# Altium project Hall sensor V1.PrjPcb (part 2 of 2)

## Sheet Hall sensor V1 power.SchDoc
size A4
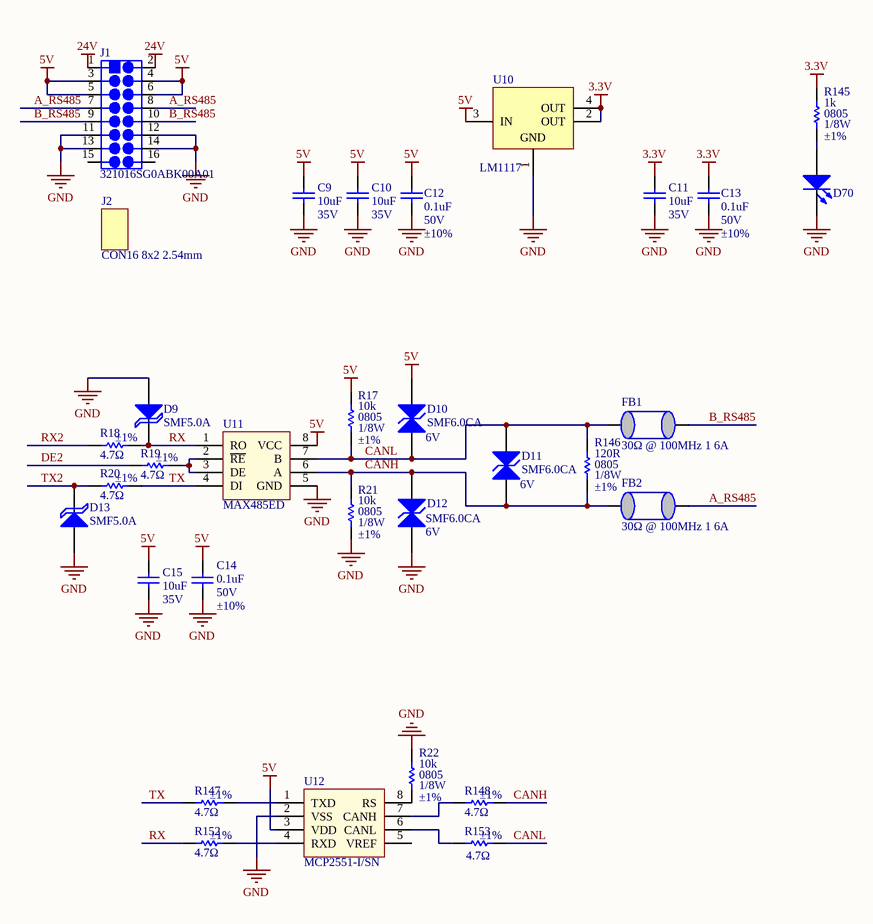
[diagram p3: Hall sensor V1 power.SchDoc]

### Parts
C9  Voltage: 35V  [CAP_SMD_0805]  (hidden comment: 10uF)
C10  Voltage: 35V  [CAP_SMD_0805]  (hidden comment: 10uF)
C11  Voltage: 35V  [CAP_SMD_0805]  (hidden comment: 10uF)
C12  Voltage: 50V  Tolerance: ±10%  [CAP_SMD_0805]  (hidden comment: 0.1uF)
C13  Voltage: 50V  Tolerance: ±10%  [CAP_SMD_0805]  (hidden comment: 0.1uF)
C14  Voltage: 50V  Tolerance: ±10%  [CAP_SMD_0805]  (hidden comment: 0.1uF)
C15  Voltage: 35V  [CAP_SMD_0805]  (hidden comment: 10uF)
D9  SMF5.0A  [SOD-123]
D10  SMF6.0CA  Voltage: 6V  [SOD-123]
D11  SMF6.0CA  Voltage: 6V  [SOD-123]
D12  Voltage: 6V  [SOD-123]  (hidden comment: SMF6.0CA)
D13  SMF5.0A  [SOD-123]
D70  17-21/R6C-AQ2R2B/3T  [LED_SMD0805]  (value not drawn)
FB1  30Ω @ 100MHz 1 6A  [Inductor 0805]
FB2  30Ω @ 100MHz 1 6A  [Inductor 0805]
J1  MANUFACTURER1_PART#: 321016SG0ABK00A01  [Header IDC 8x2 2.54mm through hold]  (hidden comment: header16 8x2 2.54mm)
J2  CON16 8x2 2.54mm  (mechanical)
R17  PCB Footprint: 0805  Power: 1/8W  Tolerance: ±1%  [RES_SMD_0805]  (hidden comment: 10k)
R18  value 4.7Ω  Tolerance: ±1%  [RES_SMD_0805]  (hidden comment: 4.7R)
R19  value 4.7Ω  Tolerance: ±1%  [RES_SMD_0805]  (hidden comment: 4.7R)
R20  value 4.7Ω  Tolerance: ±1%  [RES_SMD_0805]  (hidden comment: 4.7R)
R21  PCB Footprint: 0805  Power: 1/8W  Tolerance: ±1%  [RES_SMD_0805]  (hidden comment: 10k)
R22  PCB Footprint: 0805  Power: 1/8W  Tolerance: ±1%  [RES_SMD_0805]  (hidden comment: 10k)
R145  value 1k  PCB Footprint: 0805  Power: 1/8W  Tolerance: ±1%  [RES_SMD_0805]  (hidden comment: 10k)
R146  PCB Footprint: 0805  Power: 1/8W  Tolerance: ±1%  [RES_SMD_0805]  (hidden comment: 120R)
R147  value 4.7Ω  Tolerance: ±1%  [RES_SMD_0805]  (hidden comment: 4.7R)
R148  value 4.7Ω  Tolerance: ±1%  [RES_SMD_0805]  (hidden comment: 4.7R)
R152  value 4.7Ω  Tolerance: ±1%  [RES_SMD_0805]  (hidden comment: 4.7R)
R153  value 4.7Ω  Tolerance: ±1%  [RES_SMD_0805]  (hidden comment: 4.7R)
U10  LM1117  [SOT223]
U11  MAX485ED  [SOIC8]
U12  MCP2551-I/SN  [SOIC8]

### Nets
3.3V: C11.1 C13.2 R145.2 U10.2(OUT) U10.4(OUT)
5V: C9.1 C10.1 C12.2 C14.2 C15.1 D10.1(K) J1.3 J1.4 J1.5 J1.6 R17.2 U10.3(IN) U11.8(VCC) U12.3(VDD)
24V: J1.1 J1.2
GND: C9.2 C10.2 C11.2 C12.1 C13.1 C14.1 C15.2 D9.2(A) D12.2(A) D13.2(A) D70.1(A) J1.11 J1.12 J1.13 J1.14 R21.1 R22.2 U10.1(GND) U11.5(GND) U12.2(VSS)
A_RS485: FB2.2 J1.7 J1.8
B_RS485: FB1.2 J1.9 J1.10
CANH: D11.2(A) D12.1(K) FB2.1 R21.2 R146.1 R148.1 U11.6(A)
CANL: D10.2(A) D11.1(K) FB1.1 R17.1 R146.2 R153.1 U11.7(B)
DE2: R19.2
RX: D9.1(K) R18.1 R152.2 U11.1(RO)
RX2: R18.2
TX: R20.1 R147.2 U11.4(DI)
TX2: D13.1(K) R20.2
NetD70_2: D70.2(K) R145.1
NetR19_1: R19.1 U11.2(~{RE}) U11.3(DE)
NetR22_1: R22.1 U12.8(RS)
NetR147_1: R147.1 U12.1(TXD)
NetR148_2: R148.2 U12.7(CANH)
NetR152_1: R152.1 U12.4(RXD)
NetR153_2: R153.2 U12.6(CANL)

Not connected (* = marked no-connect by the designer): J1 15 16; J2 1 2; U12 5(VREF)

### Library data of the parts
C9-C11 C15 = Cap-NP-100: 10uF ±10% 35V X5R 0805 Multilayer Ceramic Capacitors MLCC - SMD/SMT RoHS; MANUFACTURER1: Murata Electronics; MANUFACTURER1_PART#: GRM21BR6YA106KE43L; MANUFACTURER2_PART#: C2012X5R1V106MT000E; PACKING: Tape & Reel (TR); PCB Footprint: 0805; Process Type: SM; Unit: PCS; By: Thanh Son; Value: 10uF; MANUFACTURER2: TDK; Tolerance: ±10%; Material: X5R; Category: Cap Cereramic; Mounting Type: SM; Package / Case: 0805; Supplier 1: LCSC
C12-C14 = Cap-NP-100: 100nF ±10% 50V X7R 0805 Multilayer Ceramic Capacitors MLCC - SMD/SMT RoHS; MANUFACTURER1: TORCH; MANUFACTURER1_PART#: C0805B104K500NT; MANUFACTURER2_PART#: TCC0805X7R104K500DT; PACKING: Tape & Reel (TR); PCB Footprint: 0805; Process Type: SM; Unit: PCS; By: Thanh Son; Value: 0.1uF; MANUFACTURER2: CCTC; Material: X7R; Category: Cap Cereramic; Mounting Type: SM; Package / Case: 0805; Supplier 1: LCSC
D9 D13 = TVS SMF26A: SOD-123FL TVS RoHS; MANUFACTURER1: Slkor(SLKORMICRO Elec.); Current: 4.8mA; PACKING: Tape & Reel; Process Type: SM; Unit: PCS; Value: SMF26A; By: Thanh Son; MANUFACTURER2: SUNMATE Elec; MANUFACTURER2_PART#: SMF5.0A; MANUFACTURER1_PART#: SMF5.0A; Category: ESD/TVS; Mounting Type: SM; Package / Case: SOD-123; Supplier 1: LCSC
D10-D12 = TVS SMF05CA  SOD123: Bidirectional 6V 6.67V 10.3V 19.4mA SOD-123FL TVS RoHS; MANUFACTURER1: SUNMATE Elec; PACKING: Tape & Reel; Process Type: SM; Unit: PCS; By: Thanh Son; MANUFACTURER1_PART#: SMF6.0CA; MANUFACTURER2: ZHIDE; MANUFACTURER2_PART#: SMF6.0CA; Category: ESD/TVS; Mounting Type: SM; Package / Case: SOD-123; Supplier 1: LCSC
D70 = LED_RED_SMD_0805: Red 617.5~633.5nm 0805 Light Emitting Diodes (LED) ROHS; MANUFACTURER1: Everlight Elec; MANUFACTURER2_PART#: HSMH-C170; PACKING: Tape & Reel (TR); Process Type: SM; Category: LED; MANUFACTURER1_PART#: 17-21/R6C-AQ2R2B/3T; MANUFACTURER2: AVAGO(Broadcom); Supplier 1: LCSC
FB1 FB2 = inductor ferrite bead: 30Ω @ 100MHz 1 6A 10mΩ 0805 Ferrite Beads ROHS; MANUFACTURER1: FH(Guangdong Fenghua Advanced Tech); MANUFACTURER1_PART#: CBM201209U300T; MANUFACTURER2_PART#: HCB2012KF-300T60; PACKING: Tape & Reel; Process Type: SM; By: Thanh Son; Category: Ferrite bead; MANUFACTURER2: TAI-TECH; Mounting Type: SM; Package / Case: 0805; Supplier 1: LCSC
J1 = header 8x2 JILN: 16 2 0.100"(2.54mm) Header Through Hole,P=2.54mm IDC Connectors ROHS; MANUFACTURER1: JILN; MANUFACTURER2_PART#: B-3000S16P-0110; Current: 3A; PACKING: Bag-packed; Process Type: SM; By: Thanh Son; Category: Connector; MANUFACTURER2: Ckmtw(Shenzhen Cankemeng); Package / Case: Header IDC 8x2; Supplier 1: LCSC; Mounting Type: MA
J2 = CON 2 WJ2EDGR-5.08-2P: 16 2 0.100"(2.54mm) - IDCconnector P=2.54mm IDC Connectors ROHS; MANUFACTURER1: JILN; MANUFACTURER1_PART#: 531416YBS0BW01; MANUFACTURER2_PART#: I-1010316P-B000; Current: 3A; PACKING: Bag-packed; Process Type: ASY; Unit: PCS; By: Thanh Son; MANUFACTURER2: Ckmtw(Shenzhen Cankemeng); Category: Connector; Mounting Type: ASY; Supplier 1: LCSC
R17 R21 R22 = Res0.3: 10kΩ ±1% 1/8W ±100ppm/℃ 0805 Chip Resistor - Surface Mount RoHS; MANUFACTURER1: UNI-ROYAL(Uniroyal Elec); MANUFACTURER1_PART#: 0805W8F1002T5E; MANUFACTURER2_PART#: RS-05K1002FT; PACKING: Tape & Reel (TR); Process Type: SM; Unit: PCS; By: Thanh Son; Value: 10k; MANUFACTURER2: FH(Guangdong Fenghua Advanced Tech); Category: Resistor; Mounting Type: SM; Package / Case: 0805; Supplier 1: LCSC
R18-R20 R147 R148 R152 R153 = Res0.3: 4.7Ω ±1% ±400ppm/℃ 0.125W 0805 Chip Resistor - Surface Mount ROHS; MANUFACTURER1: UNI-ROYAL(Uniroyal Elec); MANUFACTURER1_PART#: 0805W8F470KT5E; MANUFACTURER2_PART#: RC0805FR-074R7L; PACKING: Tape & Reel (TR); PCB Footprint: 0805; Process Type: SM; Unit: PCS; Power: 1/8W; MANUFACTURER2: YAGEO; Category: Resistor; Mounting Type: SM; Package / Case: 0805; Supplier 1: LCSC
R145 = Res0.3: 10kΩ ±1% 1/8W ±100ppm/℃ 0805 Chip Resistor - Surface Mount RoHS; MANUFACTURER1: YAGEO; MANUFACTURER1_PART#: AC0805FR-071KL; MANUFACTURER2_PART#: WR08X1001FTL; PACKING: Tape & Reel (TR); Process Type: SM; Unit: PCS; By: Thanh Son; MANUFACTURER2: Walsin Tech Corp; Category: Resistor; Mounting Type: SM; Package / Case: 0805; Supplier 1: LCSC
R146 = Res0.3: ±1% ±100ppm/℃ 120Ω 0.125W 0805 Chip Resistor - Surface Mount ROHS; MANUFACTURER1: UNI-ROYAL(Uniroyal Elec); MANUFACTURER1_PART#: 0805W8F1200T5E; MANUFACTURER2_PART#: AC0805FR-7W120RL; PACKING: Tape & Reel (TR); Process Type: SM; Unit: PCS; By: Thanh Son; Value: 120R; MANUFACTURER2: YAGEO; Category: Resistor; Mounting Type: SM; Package / Case: 0805; Supplier 1: LCSC
U10 = LM1117: Fixed 18V 3.3V 1.4V @ 1A SOT-223 Dropout Regulators(LDO) RoHS; MANUFACTURER1: Slkor(SLKORMICRO Elec.); MANUFACTURER1_PART#: AMS1117-3.3; PACKING: Tape & Reel; Process Type: SM; Unit: PCS; By: Thanh Son; MANUFACTURER2: PUOLOP; MANUFACTURER2_PART#: AMS1117-3.3; Value: 3.3V; Current: 1A; Voltage: 3.3V; Category: IC; Mounting Type: SM; Package / Case: SOT223; Supplier 1: LCSC
U11 = RS 485 SIT3485ESA: Transceiver RS485 1/1 200kbps SOIC-8_150mil RS-485/RS-422 ICs RoHS; MANUFACTURER1: HTC Korea TAEJIN Tech; MANUFACTURER2_PART#: CBM485AS8; PACKING: Tape & Reel; Process Type: SM; Unit: PCS; By: Thanh Son; MANUFACTURER1_PART#: MAX485ED; MANUFACTURER2: Corebai Microelectronics; Category: IC; Mounting Type: SM; Package / Case: SOP-8; Supplier 1: LCSC
U12 = CAN MCP2551-I/SN: Transceiver 1/1 CAN - SOIC-8_150mil CAN ICs ROHS; MANUFACTURER1: Microchip Tech; MANUFACTURER2_PART#: PCA82C250T/YM,118; PACKING: Tape & Reel; Process Type: SM; Unit: PCS; By: Thanh Son; Category: IC; MANUFACTURER1_PART#: MCP2551-I/SN; MANUFACTURER2: NXP Semicon; Mounting Type: SM; Package / Case: SOIC8; Supplier 1: LCSC

## Sheet hall sensor MCU_1.SchDoc
size A3
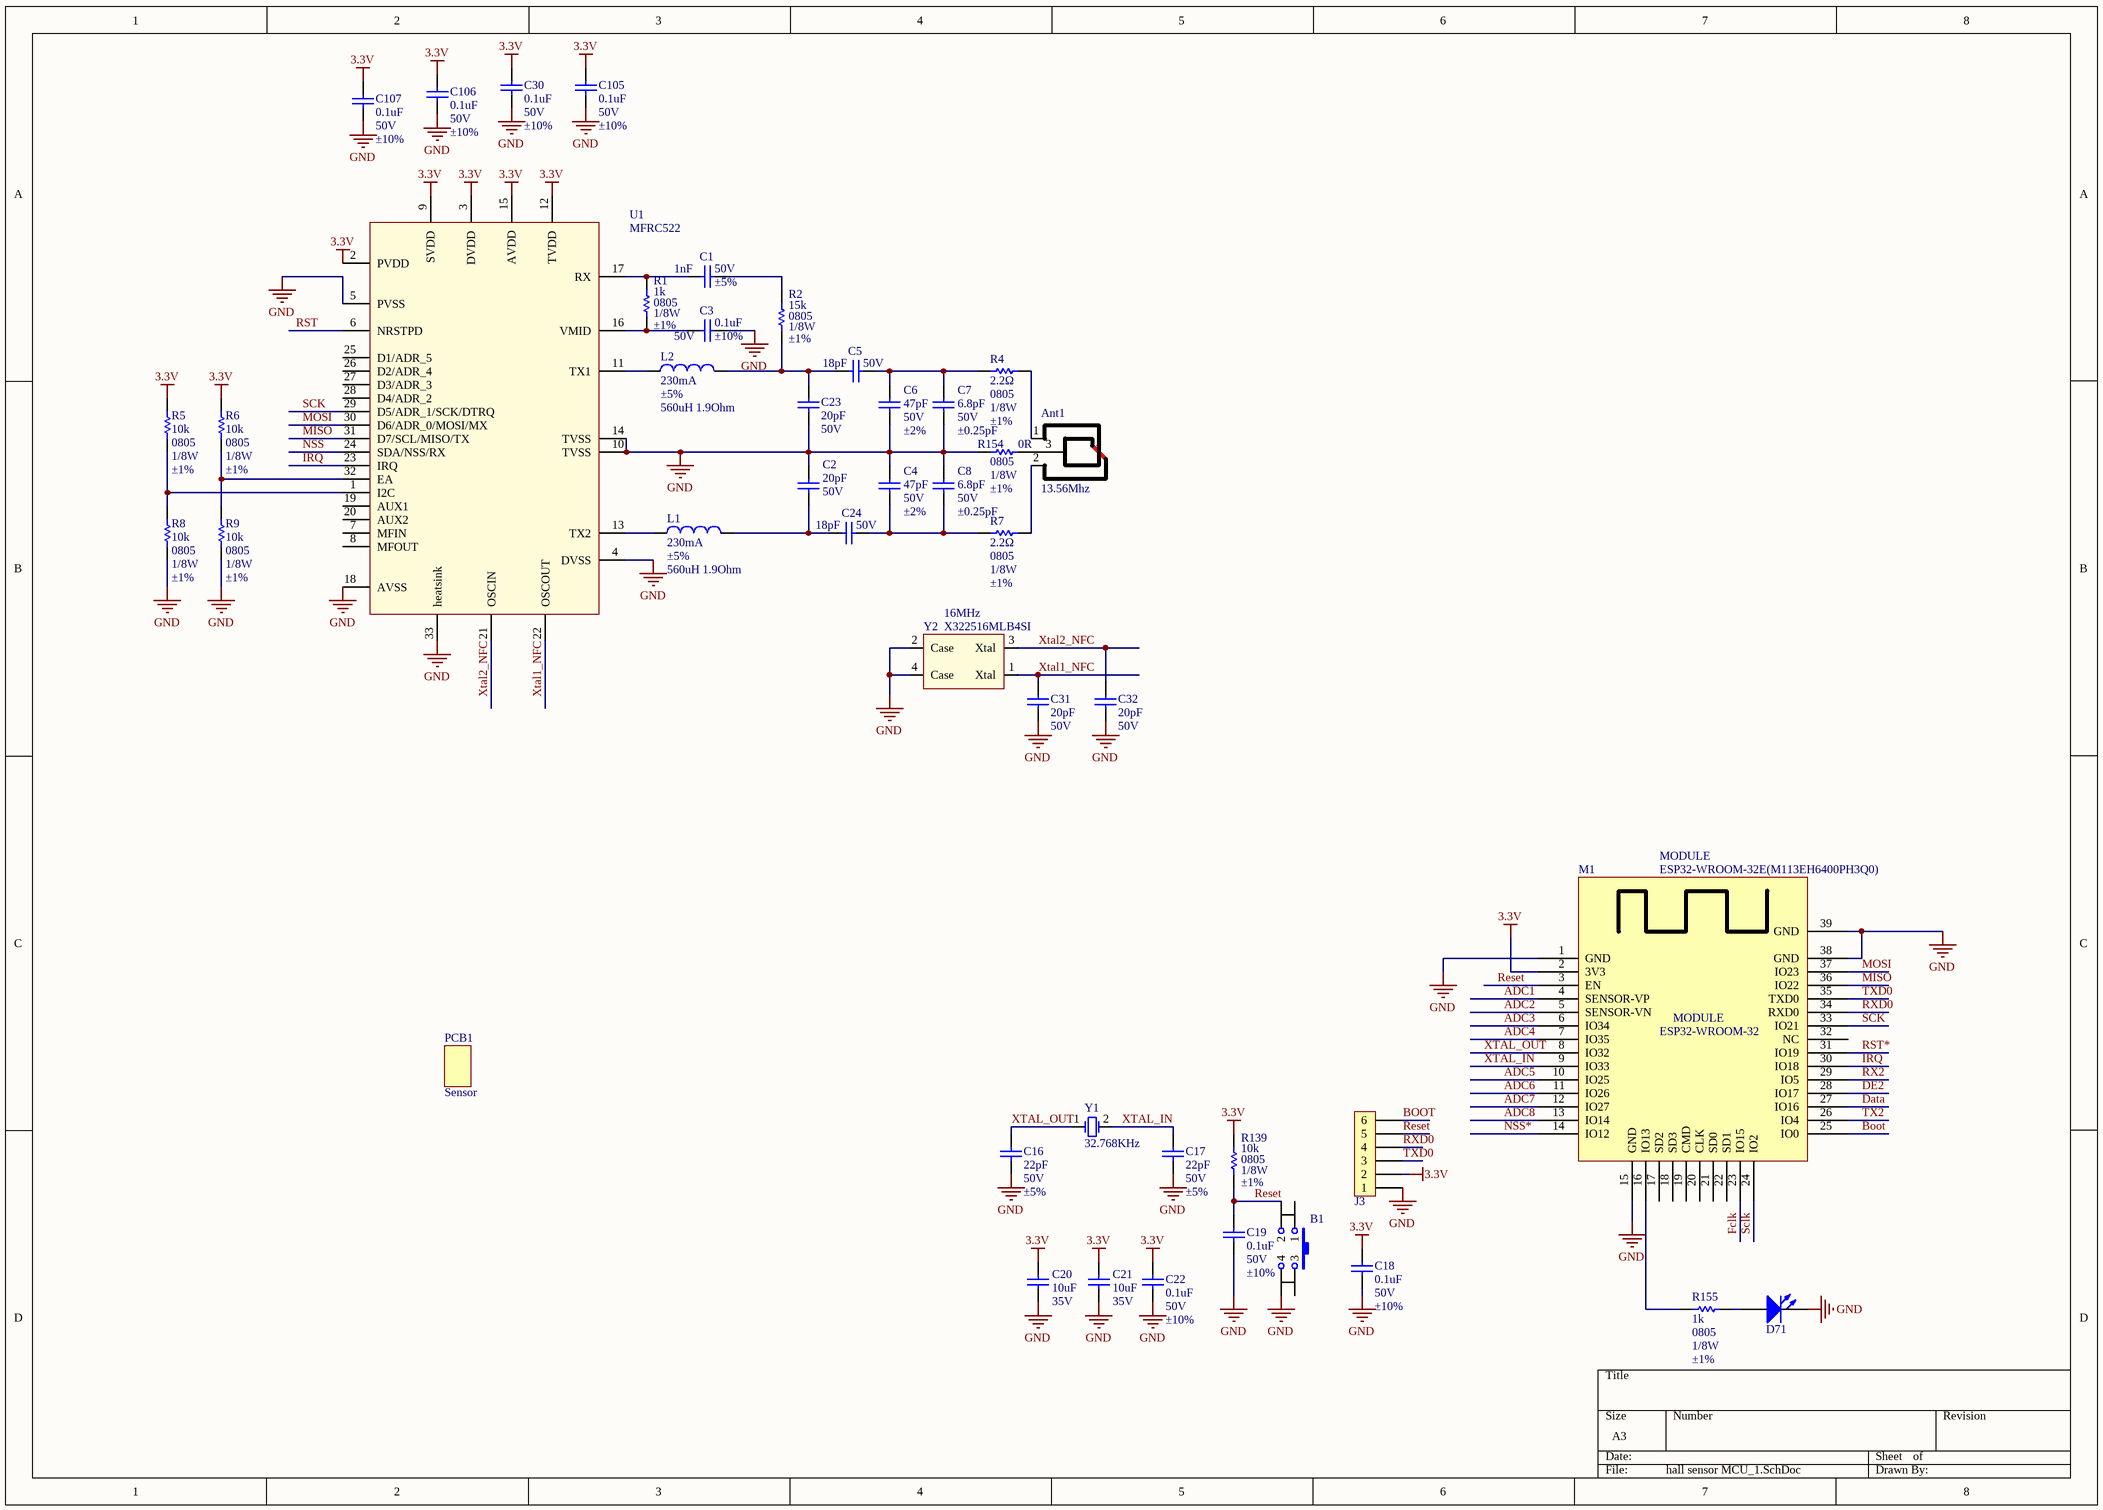
[diagram p4: hall sensor MCU_1.SchDoc]

### Parts
Ant1  13.56Mhz  [antenna 13.56_V2]  (no BOM)
B1  button SMD 6x6x5  [button 250 smd]  (value not drawn)
C1  Voltage: 50V  Tolerance: ±5%  [CAP_SMD_0805]  (hidden comment: 1nF)
C2  value 20pF  Voltage: 50V  [CAP_SMD_0805]  (hidden comment: 220pF)
C3  Voltage: 50V  Tolerance: ±10%  [CAP_SMD_0805]  (hidden comment: 0.1uF)
C4  Voltage: 50V  Tolerance: ±2%  [CAP_SMD_0805]  (hidden comment: 47pF)
C5  Voltage: 50V  [CAP_SMD_0805]  (hidden comment: 18pF)
C6  Voltage: 50V  Tolerance: ±2%  [CAP_SMD_0805]  (hidden comment: 47pF)
C7  Voltage: 50V  Tolerance: ±0.25pF  [CAP_SMD_0805]  (hidden comment: 6.8pF)
C8  Voltage: 50V  Tolerance: ±0.25pF  [CAP_SMD_0805]  (hidden comment: 6.8pF)
C16  Voltage: 50V  Tolerance: ±5%  [CAP_SMD_0805]  (hidden comment: 22pF)
C17  Voltage: 50V  Tolerance: ±5%  [CAP_SMD_0805]  (hidden comment: 22pF)
C18  Voltage: 50V  Tolerance: ±10%  [CAP_SMD_0805]  (hidden comment: 0.1uF)
C19  Voltage: 50V  Tolerance: ±10%  [CAP_SMD_0805]  (hidden comment: 0.1uF)
C20  Voltage: 35V  [CAP_SMD_0805]  (hidden comment: 10uF)
C21  Voltage: 35V  [CAP_SMD_0805]  (hidden comment: 10uF)
C22  Voltage: 50V  Tolerance: ±10%  [CAP_SMD_0805]  (hidden comment: 0.1uF)
C23  value 20pF  Voltage: 50V  [CAP_SMD_0805]  (hidden comment: 220pF)
C24  Voltage: 50V  [CAP_SMD_0805]  (hidden comment: 18pF)
C30  Voltage: 50V  Tolerance: ±10%  [CAP_SMD_0805]  (hidden comment: 0.1uF)
C31  value 20pF  Voltage: 50V  [CAP_SMD_0805]  (hidden comment: 0.1uF)
C32  value 20pF  Voltage: 50V  [CAP_SMD_0805]  (hidden comment: 0.1uF)
C105  Voltage: 50V  Tolerance: ±10%  [CAP_SMD_0805]  (hidden comment: 0.1uF)
C106  Voltage: 50V  Tolerance: ±10%  [CAP_SMD_0805]  (hidden comment: 0.1uF)
C107  Voltage: 50V  Tolerance: ±10%  [CAP_SMD_0805]  (hidden comment: 0.1uF)
D71  17-21/R6C-AQ2R2B/3T  [LED_SMD0805]  (value not drawn)
J3  JUMPER 6  [JUMPER6]  (value not drawn)  (no BOM)
L1  value 560uH 1.9Ohm  Current: 230mA  Tolerance: ±5%  [Inductor 0805]  (hidden comment: 560uH)
L2  value 560uH 1.9Ohm  Current: 230mA  Tolerance: ±5%  [Inductor 0805]  (hidden comment: 560uH)
M1  Category: MODULE  MANUFACTURER1_PART#: ESP32-WROOM-32E(M113EH6400PH3Q0)  [ESP-WROOM-32]  (hidden comment: ESP32-WROOM-32E(16MB))
PCB1  Sensor  (mechanical)
R1  value 1k  PCB Footprint: 0805  Power: 1/8W  Tolerance: ±1%  [RES_SMD_0805]  (hidden comment: 10k)
R2  PCB Footprint: 0805  Power: 1/8W  Tolerance: ±1%  [RES_SMD_0805]  (hidden comment: 15k)
R4  value 2.2Ω  PCB Footprint: 0805  Power: 1/8W  Tolerance: ±1%  [RES_SMD_0805]  (hidden comment: 2.2R)
R5  PCB Footprint: 0805  Power: 1/8W  Tolerance: ±1%  [RES_SMD_0805]  (hidden comment: 10k)
R6  PCB Footprint: 0805  Power: 1/8W  Tolerance: ±1%  [RES_SMD_0805]  (hidden comment: 10k)
R7  value 2.2Ω  PCB Footprint: 0805  Power: 1/8W  Tolerance: ±1%  [RES_SMD_0805]  (hidden comment: 2.2R)
R8  PCB Footprint: 0805  Power: 1/8W  Tolerance: ±1%  [RES_SMD_0805]  (hidden comment: 10k)
R9  PCB Footprint: 0805  Power: 1/8W  Tolerance: ±1%  [RES_SMD_0805]  (hidden comment: 10k)
R139  PCB Footprint: 0805  Power: 1/8W  Tolerance: ±1%  [RES_SMD_0805]  (hidden comment: 10k)
R154  0R  PCB Footprint: 0805  Power: 1/8W  Tolerance: ±1%  [RES_SMD_0805]
R155  value 1k  PCB Footprint: 0805  Power: 1/8W  Tolerance: ±1%  [RES_SMD_0805]  (hidden comment: 10k)
U1  MFRC522  [HVQFN32]
Y1  32.768KHz  [FC135]
Y2  MANUFACTURER1_PART#: X322516MLB4SI  [Crystal 3.2x2.5mm 4Pin]  (hidden comment: 16MHz)

### Nets
3.3V: C18.2 C20.1 C21.1 C22.2 C30.2 C105.2 C106.2 C107.2 J3.2 M1.2(3V3) R5.1 R6.1 R139.2 U1.2(PVDD) U1.3(DVDD) U1.9(SVDD) U1.12(TVDD) U1.15(AVDD)
GND: B1.4 C2.2 C3.1 C4.1 C6.2 C7.2 C8.1 C16.1 C17.1 C18.1 C19.1 C20.2 C21.2 C22.1 C23.1 C30.1 C31.1 C32.1 C105.1 C106.1 C107.1 D71.1(A) J3.1 M1.1(GND) M1.15(GND) M1.38(GND) M1.39(GND) R8.2 R9.2 R154.2 U1.4(DVSS) U1.5(PVSS) U1.10(TVSS) U1.14(TVSS) U1.18(AVSS) U1.33(heatsink) Y2.2(Case) Y2.4(Case)
ADC1: M1.4(SENSOR-VP)
ADC2: M1.5(SENSOR-VN)
ADC3: M1.6(IO34)
ADC4: M1.7(IO35)
ADC5: M1.10(IO25)
ADC6: M1.11(IO26)
ADC7: M1.12(IO27)
ADC8: M1.13(IO14)
Boot: J3.6 M1.25(IO0)
Data: M1.27(IO16)
DE2: M1.28(IO17)
Fclk: M1.23(IO15)
IRQ: M1.30(IO18) U1.23(IRQ)
MISO: M1.36(IO22) U1.31(D7/SCL/MISO/TX)
MOSI: M1.37(IO23) U1.30(D6/ADR_0/MOSI/MX)
NSS: U1.24(SDA/NSS/RX)
NSS*: M1.14(IO12)
Reset: B1.2 C19.2 J3.5 M1.3(EN) R139.1
RST: U1.6(NRSTPD)
RST*: M1.31(IO19)
RX2: M1.29(IO5)
RXD0: J3.4 M1.34(RXD0)
SCK: M1.33(IO21) U1.29(D5/ADR_1/SCK/DTRQ)
Sclk: M1.24(IO2)
TX2: M1.26(IO4)
TXD0: J3.3 M1.35(TXD0)
Xtal1_NFC: C31.2 U1.22(OSCOUT) Y2.1(Xtal)
Xtal2_NFC: C32.2 U1.21(OSCIN) Y2.3(Xtal)
XTAL_IN: C17.2 M1.9(IO33) Y1.2(OSC2)
XTAL_OUT: C16.2 M1.8(IO32) Y1.1(OSC1)
NetAnt1_1: Ant1.1 R4.1
NetAnt1_2: Ant1.2 R7.1
NetAnt1_3: Ant1.3 R154.1
NetC1_1: C1.1 R2.2
NetC1_2: C1.2 R1.2 U1.17(RX)
NetC2_1: C2.1 C24.2 L1.2
NetC3_2: C3.2 R1.1 U1.16(VMID)
NetC4_2: C4.2 C8.2 C24.1 R7.2
NetC5_1: C5.1 C6.1 C7.1 R4.2
NetC5_2: C5.2 C23.2 L2.2 R2.1
NetD71_2: D71.2(K) R155.1
NetL1_1: L1.1 U1.13(TX2)
NetL2_1: L2.1 U1.11(TX1)
NetM1_16: M1.16(IO13) R155.2
NetR5_2: R5.2 R8.1 U1.1(I2C)
NetR6_2: R6.2 R9.1 U1.32(EA)

Not connected (* = marked no-connect by the designer): B1 1 3; M1 17(SD2) 18(SD3) 19(CMD) 20(CLK) 21(SD0) 22(SD1) 32(NC); U1 7(MFIN) 8(MFOUT) 19(AUX1) 20(AUX2) 25(D1/ADR_5) 26(D2/ADR_4) 27(D3/ADR_3) 28(D4/ADR_2)

### Notes on the sheet
- (in symbol ESP32-) ESP32-WROOM-32

### Library data of the parts
Ant1 = antenna 13.56V2: By: Thanh Son; Package / Case: Antenna 13.56V2Mhz
B1 = button 250_SMD: SPST 50mA @ 12VDC Vertical Round Button SMD,6x6x5mm Tactile Switches RoHS; MANUFACTURER1: HYP (Hongyuan Precision); MANUFACTURER1_PART#: 1TS005F-2500-5001; MANUFACTURER2_PART#: TS-1002S-04526C; PACKING: Tape & Reel (TR); Process Type: SM; Unit: PCS; By: Thanh Son; Current: 50mA; MANUFACTURER2: XUNPU; Category: Button/Switch; Mounting Type: SM; Package / Case: 6x6x5mm; Supplier 1: LCSC
C1 = Cap-NP-100: X7R 1nF ±5% 50V 0805 Multilayer Ceramic Capacitors MLCC - SMD/SMT ROHS; MANUFACTURER1: YAGEO; MANUFACTURER1_PART#: CC0805JRNPO9BN102; MANUFACTURER2_PART#: 0805CG102J500NT; PACKING: Tape & Reel (TR); PCB Footprint: 0805; Process Type: SM; Unit: PCS; Material: C0G; Value: 1nF; MANUFACTURER2: FH(Guangdong Fenghua Advanced Tech); Category: Cap Cereramic; Mounting Type: SM; Package / Case: 0805; Supplier 1: LCSC
C2 C23 = Cap-NP-100: C0G 220pF ±2% 50V 0805 Multilayer Ceramic Capacitors MLCC - SMD/SMT ROHS; MANUFACTURER1: Samsung Electro-Mechanics; MANUFACTURER1_PART#: CL21C221GBANNNC; MANUFACTURER2_PART#: CC0805GRNPO9BN221; PACKING: Tape & Reel (TR); PCB Footprint: 0805; Process Type: SM; Unit: PCS; Tolerance: ±5%; Material: NP0; MANUFACTURER2: YAGEO; Category: Cap Cereramic; Mounting Type: SM; Package / Case: 0805; Supplier 1: LCSC
C3 C18 C19 C22 C30 C105-C107 = Cap-NP-100: as C12-C14 on sheet Hall sensor V1 power; Value: 0.1uF; MANUFACTURER2: CCTC; Material: X7R; Category: Cap Cereramic; Mounting Type: SM; Package / Case: 0805; Supplier 1: LCSC
C4 C6 = Cap-NP-100: NP0 ±2% 50V 47pF 0805 Multilayer Ceramic Capacitors MLCC - SMD/SMT ROHS; MANUFACTURER1: YAGEO; MANUFACTURER1_PART#: CC0805GRNPO9BN470; MANUFACTURER2_PART#: 0805CG470J500NT; PACKING: Tape & Reel (TR); PCB Footprint: 0805; Process Type: SM; Unit: PCS; Material: C0G; By: Thanh Son; Value: 47pF; MANUFACTURER2: FH(Guangdong Fenghua Advanced Tech); Category: Cap Cereramic; Mounting Type: SM; Package / Case: 0805; Supplier 1: LCSC
C5 C24 = Cap-NP-100: C0G 18pF ±2% 100V 0805 Multilayer Ceramic Capacitors MLCC - SMD/SMT ROHS; MANUFACTURER1: FH(Guangdong Fenghua Advanced Tech); MANUFACTURER1_PART#: 0805CG180G101NT; MANUFACTURER2_PART#: CC0805GRNPO9BN180; PACKING: Tape & Reel (TR); PCB Footprint: 0805; Process Type: SM; Unit: PCS; Tolerance: ±5%; Material: NP0; Value: 18pF; MANUFACTURER2: YAGEO; Category: Cap Cereramic; Mounting Type: SM; Package / Case: 0805; Supplier 1: LCSC
C7 C8 = Cap-NP-100: NP0 6.8pF ±0.25pF 50V 0805 Multilayer Ceramic Capacitors MLCC - SMD/SMT ROHS; MANUFACTURER1: YAGEO; MANUFACTURER1_PART#: CC0805CRNPO9BN6R8; MANUFACTURER2_PART#: 0805CG6R8C500NT; PACKING: Tape & Reel (TR); PCB Footprint: 0805; Process Type: SM; Unit: PCS; Material: C0G; Value: 6.8pF; MANUFACTURER2: FH(Guangdong Fenghua Advanced Tech); Category: Cap Cereramic; Mounting Type: SM; Package / Case: 0805; Supplier 1: LCSC
C16 C17 = Cap-NP-100: 22pF ±5% 50V NP0 0805 Multilayer Ceramic Capacitors MLCC - SMD/SMT RoHS; MANUFACTURER1: YAGEO; MANUFACTURER1_PART#: CC0805JRNPO9BN220; MANUFACTURER2_PART#: PSA(Prosperity Dielectrics); PACKING: Tape & Reel (TR); PCB Footprint: 0805; Process Type: SM; Unit: PCS; By: Thanh Son; Value: 22pF; MANUFACTURER2: FN21N220J500PAG; Material: NP0; Category: Cap Cereramic; Mounting Type: SM; Package / Case: 0805; Supplier 1: LCSC
C20 C21 = Cap-NP-100: as C9-C11 on sheet Hall sensor V1 power; Value: 10uF; MANUFACTURER2: TDK; Tolerance: ±10%; Material: X5R; Category: Cap Cereramic; Mounting Type: SM; Package / Case: 0805; Supplier 1: LCSC
C31 C32 = Cap-NP-100: 100nF ±10% 50V X7R 0805 Multilayer Ceramic Capacitors MLCC - SMD/SMT RoHS; MANUFACTURER1: FH(Guangdong Fenghua Advanced Tech); MANUFACTURER1_PART#: 0805CG200J500NT; MANUFACTURER2_PART#: CC0805JRNPO9BN200; PACKING: Tape & Reel (TR); PCB Footprint: 0805; Process Type: SM; Unit: PCS; Tolerance: ±5%; Material: NP0; MANUFACTURER2: YAGEO; Category: Cap Cereramic; Mounting Type: SM; Package / Case: 0805; Supplier 1: LCSC
D71 = LED_RED_SMD_0805: as D70 on sheet Hall sensor V1 power; Category: LED; MANUFACTURER1_PART#: 17-21/R6C-AQ2R2B/3T; MANUFACTURER2: AVAGO(Broadcom); Supplier 1: LCSC
J3 = JUMPER 6: Process Type: MA; Unit: PCS; By: Thanh Son; Category: Connector; Mounting Type: MA; Package / Case: JUMPER6
L1 L2 = inductor 2.2uF: 0805 Inductors (SMD) ROHS; MANUFACTURER1: FH(Guangdong Fenghua Advanced Tech); MANUFACTURER1_PART#: FHW0805UCR56JGT; MANUFACTURER2_PART#: CMCW2012CR56JST; PACKING: Tape & Reel (TR); By: Thanh Son; MANUFACTURER2: Cybermax; Process Type: SMD; Category: Inductor; Mounting Type: SM; Package / Case: 0805; Supplier 1: LCSC
M1 = ESP32-: SMD38,18x25.5x3.1 WiFi Modules ROHS; MANUFACTURER1: Espressif Systems; MANUFACTURER2_PART#: ESP32-WROOM-32E(M113EH3200PS3Q0); PACKING: Tape & Reel (TR); PCB Footprint: 38-SMD Module; Process Type: SMD; Voltage: 3.3V; By: Thanh Son; MANUFACTURER2: Espressif Systems; Mounting Type: SM; Package / Case: ESP-WROOM-32; Supplier 1: mouser
PCB1 = CON Housings 4PIN 1x4 XHB－4Y: FR4; 1.6mm; 1OZ;TG130-140; color Purple; 2 layer; Silkscreen White; Surface Finish HASL lead free; MANUFACTURER2_PART#: 280x180mm; Manufacturer: PNLABVN.vn; MANUFACTURER2: machinchatluong.vn; Manufacturer Part Number: 280x180mm; MANUFACTURER1: PNLABVN.vn; MANUFACTURER1_PART#: 280x180mm
R1 R155 = Res0.3: as R145 on sheet Hall sensor V1 power; MANUFACTURER2: Walsin Tech Corp; Category: Resistor; Mounting Type: SM; Package / Case: 0805; Supplier 1: LCSC
R2 = Res0.3: -55℃~+155℃ ±1% 150V Thick Film Resistors 125mW ±100ppm/℃ 15kΩ 0805 Chip Resistor - Surface Mount ROHS; MANUFACTURER1: YAGEO; MANUFACTURER1_PART#: RC0805FR-0715KL; MANUFACTURER2_PART#: 0805W8F1502T5E; PACKING: Tape & Reel (TR); Process Type: SM; Unit: PCS; By: Thanh Son; Value: 15k; MANUFACTURER2: UNI-ROYAL(Uniroyal Elec); Category: Resistor; Mounting Type: SM; Package / Case: 0805; Supplier 1: LCSC
R4 R7 = Res0.3: 2.2Ω -55℃~+155℃ ±1% ±200ppm/℃ 150V Thick Film Resistors 125mW 0805 Chip Resistor - Surface Mount ROHS; MANUFACTURER1: YAGEO; MANUFACTURER1_PART#: RC0805FR-072R2L; MANUFACTURER2_PART#: 0805W8F220KT5E; PACKING: Tape & Reel (TR); Process Type: SM; Unit: PCS; By: Thanh Son; MANUFACTURER2: UNI-ROYAL(Uniroyal Elec); Category: Resistor; Mounting Type: SM; Package / Case: 0805; Supplier 1: LCSC
R5 R6 R8 R9 R139 = Res0.3: as R17 on sheet Hall sensor V1 power; Value: 10k; MANUFACTURER2: FH(Guangdong Fenghua Advanced Tech); Category: Resistor; Mounting Type: SM; Package / Case: 0805; Supplier 1: LCSC
R154 = Res0.3: ±1% 0Ω 0.125W 0805 Chip Resistor - Surface Mount ROHSSurface Mount ROHS; MANUFACTURER1: YAGEO; MANUFACTURER1_PART#: RC0805FR-070RL; MANUFACTURER2_PART#: 0805W8F0000T5E; PACKING: Tape & Reel (TR); Process Type: SM; Unit: PCS; By: Thanh Son; Value: 0Ω; MANUFACTURER2: UNI-ROYAL(Uniroyal Elec); Category: Resistor; Mounting Type: SM; Package / Case: 0805; Supplier 1: LCSC
U1 = MFRC522: RFID Reader IC 13.56MHz ISO 14443, MIFARE I²C, SPI, UART 2.5V ~ 3.3V 32-VFQFN Exposed Pad; MANUFACTURER1: NXP USA Inc.; MANUFACTURER1_PART#: MFRC52202HN1,115; PACKING: Tape & Reel (TR); Process Type: SM; Unit: PCS; By: Thanh Son; Category: IC; Mounting Type: SM; Package / Case: HVQFN32; Supplier 1: mouser
Y1 = Crystal FC135: 32.768KHz ±10ppm 12.5pF 70kΩ SMD-3215 SMD Crystal Resonators RoHS; MANUFACTURER1: TKD; MANUFACTURER1_PART#: SF32WK32768D31T002; MANUFACTURER2_PART#: SMD31327681252090; PACKING: Tape & Reel (TR); Process Type: SM; Unit: PCS; Value: AH03270014; By: Thanh Son; MANUFACTURER2: JGHC; Category: Crystal; Mounting Type: SM; Package / Case: SMD3215-2P; Supplier 1: LCSC
Y2 = Crystal FL0800008Q: 16MHz ±10ppm 9pF 60Ω SMD-3225_4P Crystals RoHS; MANUFACTURER1: Yangxing Tech; MANUFACTURER2_PART#: 7325-1600A0810-01; PACKING: Cut Tape (CT); PCB Footprint: 3.20mm x 2.50mm; Process Type: SMT; By: Thanh Son; Category: Crystal; MANUFACTURER2: XTY; Tolerance: ±10ppm; Value: 16MHz; Mounting Type: SMT; Package / Case: Crystal 3.2x2.5mm 4Pin; Supplier 1: LCSC

## Nets that join several sheets
3.3V: Hall sensor V1 power (5 pins), hall sensor MCU_1 (18 pins)
5V: Hall sensor V1 sensor_1 (225 pins), Hall sensor V1 power (14 pins)
GND: Hall sensor V1 sensor_1 (172 pins), Hall sensor V1 power (20 pins), hall sensor MCU_1 (38 pins)
ADC1: Hall sensor V1 sensor_1 (C25.2 R156.1), hall sensor MCU_1 (M1.4)
ADC2: Hall sensor V1 sensor_1 (C26.2 R157.1), hall sensor MCU_1 (M1.5)
ADC3: Hall sensor V1 sensor_1 (C27.2 R158.1), hall sensor MCU_1 (M1.6)
ADC4: Hall sensor V1 sensor_1 (C28.2 R159.1), hall sensor MCU_1 (M1.7)
ADC5: Hall sensor V1 sensor_1 (C109.2 R149.1), hall sensor MCU_1 (M1.10)
ADC6: Hall sensor V1 sensor_1 (C110.2 R150.1), hall sensor MCU_1 (M1.11)
ADC7: Hall sensor V1 sensor_1 (C111.2 R151.1), hall sensor MCU_1 (M1.12)
ADC8: Hall sensor V1 sensor_1 (C29.2 R160.1), hall sensor MCU_1 (M1.13)
Data: Hall sensor V1 sensor_1 (U9.14), hall sensor MCU_1 (M1.27)
DE2: Hall sensor V1 power (R19.2), hall sensor MCU_1 (M1.28)
Fclk: Hall sensor V1 sensor_1 (8 pins), hall sensor MCU_1 (M1.23)
RX2: Hall sensor V1 power (R18.2), hall sensor MCU_1 (M1.29)
Sclk: Hall sensor V1 sensor_1 (8 pins), hall sensor MCU_1 (M1.24)
TX2: Hall sensor V1 power (D13.1 R20.2), hall sensor MCU_1 (M1.26)